# EAGLE design secam-perif94 (EAGLE 6.3)
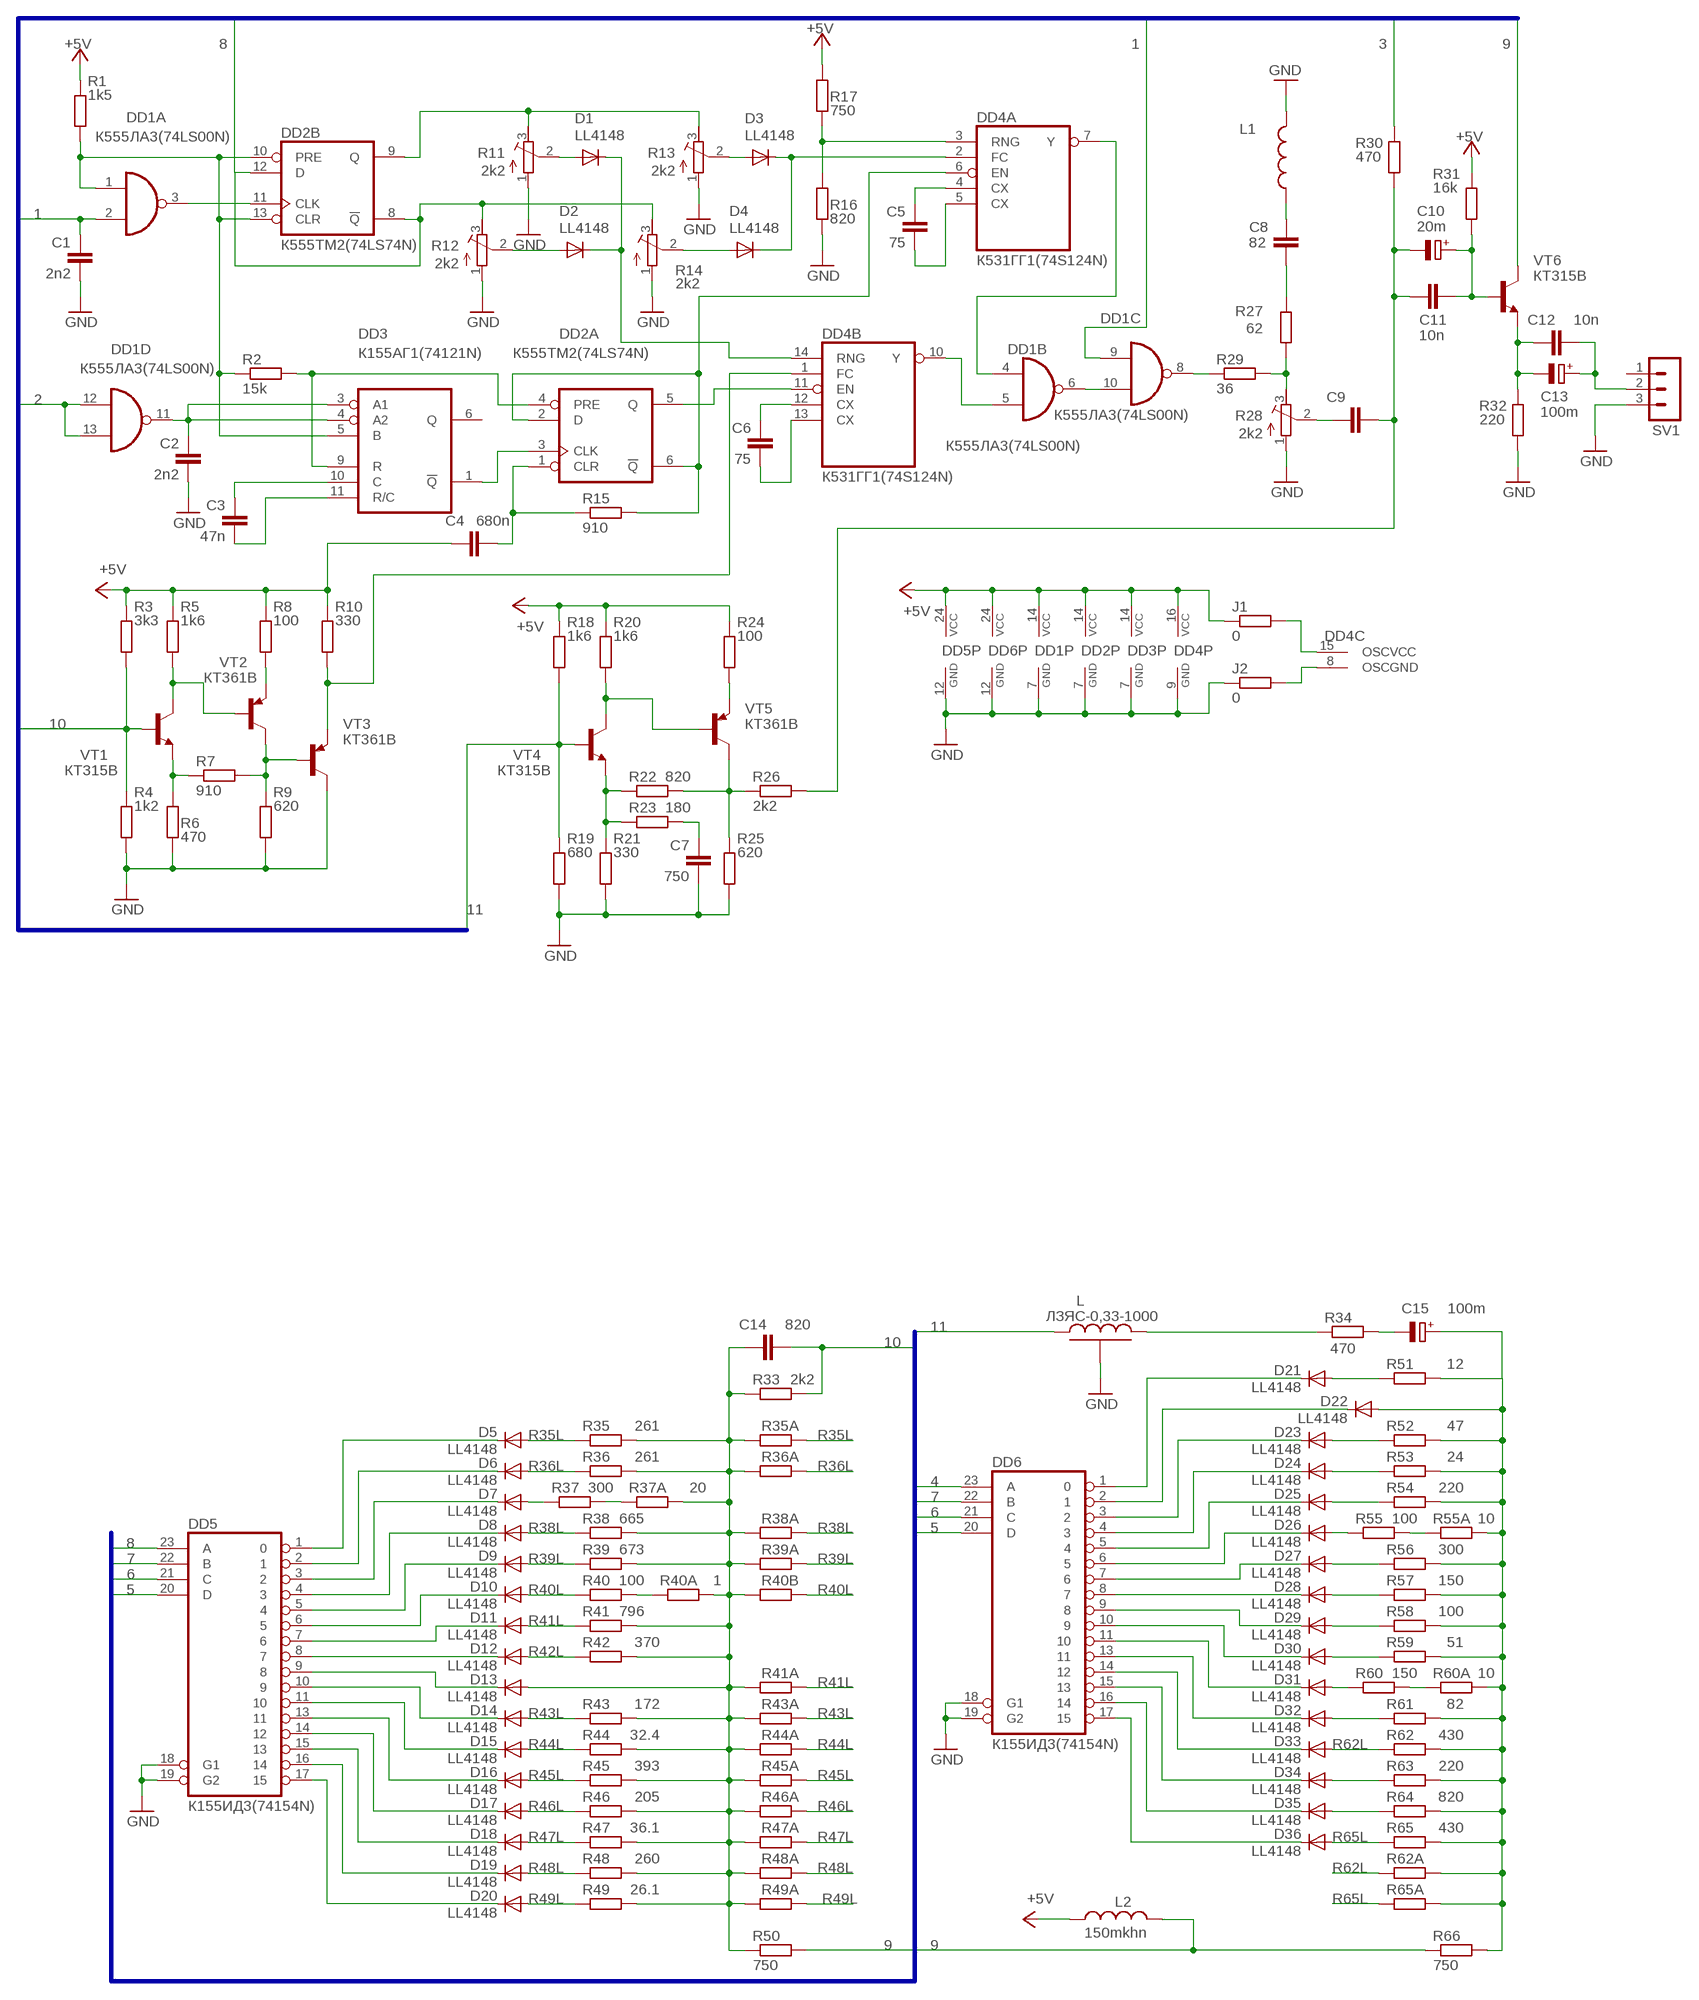
[diagram p0: schematic, sheet 1]

## Parts
C1  2n2  C-EU025-025X050  [C025-025X050]
C2  2n2  C-EU025-025X050  [C025-025X050]
C3  47n  C-EU025-025X050  [C025-025X050]
C4  680n  C-EU025-025X050  [C025-025X050]
C5  75  C-EU025-025X050  [C025-025X050]
C6  75  C-EU025-025X050  [C025-025X050]
C7  750  C-EU025-025X050  [C025-025X050]
C8  82  C-EU025-025X050  [C025-025X050]
C9  C-EU025-025X050  [C025-025X050]
C10  20m  CPOL-EUE2.5-5  [E2,5-5]
C11  10n  C-EU025-025X050  [C025-025X050]
C12  10n  C-EU025-025X050  [C025-025X050]
C13  100m  CPOL-EUE2.5-5  [E2,5-5]
C14  820  C-EU025-025X050  [C025-025X050]
C15  100m  CPOL-EUE2.5-5  [E2,5-5]
D1  LL4148  DIODE-SOD80C  [SOD80C]
D2  LL4148  DIODE-SOD80C  [SOD80C]
D3  LL4148  DIODE-SOD80C  [SOD80C]
D4  LL4148  DIODE-SOD80C  [SOD80C]
D5  LL4148  DIODE-SOD80C  [SOD80C]
D6  LL4148  DIODE-SOD80C  [SOD80C]
D7  LL4148  DIODE-SOD80C  [SOD80C]
D8  LL4148  DIODE-SOD80C  [SOD80C]
D9  LL4148  DIODE-SOD80C  [SOD80C]
D10  LL4148  DIODE-SOD80C  [SOD80C]
D11  LL4148  DIODE-SOD80C  [SOD80C]
D12  LL4148  DIODE-SOD80C  [SOD80C]
D13  LL4148  DIODE-SOD80C  [SOD80C]
D14  LL4148  DIODE-SOD80C  [SOD80C]
D15  LL4148  DIODE-SOD80C  [SOD80C]
D16  LL4148  DIODE-SOD80C  [SOD80C]
D17  LL4148  DIODE-SOD80C  [SOD80C]
D18  LL4148  DIODE-SOD80C  [SOD80C]
D19  LL4148  DIODE-SOD80C  [SOD80C]
D20  LL4148  DIODE-SOD80C  [SOD80C]
D21  LL4148  DIODE-SOD80C  [SOD80C]
D22  LL4148  DIODE-SOD80C  [SOD80C]
D23  LL4148  DIODE-SOD80C  [SOD80C]
D24  LL4148  DIODE-SOD80C  [SOD80C]
D25  LL4148  DIODE-SOD80C  [SOD80C]
D26  LL4148  DIODE-SOD80C  [SOD80C]
D27  LL4148  DIODE-SOD80C  [SOD80C]
D28  LL4148  DIODE-SOD80C  [SOD80C]
D29  LL4148  DIODE-SOD80C  [SOD80C]
D30  LL4148  DIODE-SOD80C  [SOD80C]
D31  LL4148  DIODE-SOD80C  [SOD80C]
D32  LL4148  DIODE-SOD80C  [SOD80C]
D33  LL4148  DIODE-SOD80C  [SOD80C]
D34  LL4148  DIODE-SOD80C  [SOD80C]
D35  LL4148  DIODE-SOD80C  [SOD80C]
D36  LL4148  DIODE-SOD80C  [SOD80C]
DD1  К555ЛА3(74LS00N)  74LS00N  [DIL14]
DD2  К555ТМ2(74LS74N)  74LS74N  [DIL14]
DD3  К155АГ1(74121N)  74121N  [DIL14]
DD4  К531ГГ1(74S124N)  74S124N  [DIL16]
DD5  К155ИД3(74154N)  74154N  [DIL24-6]
DD6  К155ИД3(74154N)  74154N  [DIL24-6]
J1  0  R-EU_M0805  [M0805]
J2  0  R-EU_M0805  [M0805]
L  ЛЗЯС-0,33-1000  [ЛЗЯС-0,33-1000]
L1  L-US0204/7  [0204/7]
L2  150mkhn  L-US0207/15  [0207/15]
R1  1k5  R-EU_M0805  [M0805]
R2  15k  R-EU_M0805  [M0805]
R3  3k3  R-EU_M0805  [M0805]
R4  1k2  R-EU_M0805  [M0805]
R5  1k6  R-EU_M0805  [M0805]
R6  470  R-EU_M0805  [M0805]
R7  910  R-EU_M0805  [M0805]
R8  100  R-EU_M0805  [M0805]
R9  620  R-EU_M0805  [M0805]
R10  330  R-EU_M0805  [M0805]
R11  2k2  R-TRIMM3296W  [RTRIM3296W]
R12  2k2  R-TRIMM3296W  [RTRIM3296W]
R13  2k2  R-TRIMM3296W  [RTRIM3296W]
R14  2k2  R-TRIMM3296W  [RTRIM3296W]
R15  910  R-EU_M0805  [M0805]
R16  820  R-EU_M0805  [M0805]
R17  750  R-EU_M0805  [M0805]
R18  1k6  R-EU_M0805  [M0805]
R19  680  R-EU_M0805  [M0805]
R20  1k6  R-EU_M0805  [M0805]
R21  330  R-EU_M0805  [M0805]
R22  820  R-EU_M0805  [M0805]
R23  180  R-EU_M0805  [M0805]
R24  100  R-EU_M0805  [M0805]
R25  620  R-EU_M0805  [M0805]
R26  2k2  R-EU_M0805  [M0805]
R27  62  R-EU_M0805  [M0805]
R28  2k2  R-TRIMM3296W  [RTRIM3296W]
R29  36  R-EU_M0805  [M0805]
R30  470  R-EU_M0805  [M0805]
R31  16k  R-EU_M0805  [M0805]
R32  220  R-EU_M0805  [M0805]
R33  2k2  R-EU_M0805  [M0805]
R34  470  R-EU_M0805  [M0805]
R35  261  R-EU_M0805  [M0805]
R35A  R-EU_0207/10  [0207/10]
R36  261  R-EU_M0805  [M0805]
R36A  R-EU_0207/10  [0207/10]
R37  300  R-EU_M0805  [M0805]
R37A  20  R-EU_M0805  [M0805]
R38  665  R-EU_M0805  [M0805]
R38A  R-EU_0207/10  [0207/10]
R39  673  R-EU_M0805  [M0805]
R39A  R-EU_0207/10  [0207/10]
R40  100  R-EU_M0805  [M0805]
R40A  1  R-EU_M0805  [M0805]
R40B  R-EU_0207/10  [0207/10]
R41  796  R-EU_M0805  [M0805]
R41A  R-EU_0207/10  [0207/10]
R42  370  R-EU_M0805  [M0805]
R43  172  R-EU_M0805  [M0805]
R43A  R-EU_0207/10  [0207/10]
R44  32.4  R-EU_M0805  [M0805]
R44A  R-EU_0207/10  [0207/10]
R45  393  R-EU_M0805  [M0805]
R45A  R-EU_0207/10  [0207/10]
R46  205  R-EU_M0805  [M0805]
R46A  R-EU_0207/10  [0207/10]
R47  36.1  R-EU_M0805  [M0805]
R47A  R-EU_0207/10  [0207/10]
R48  260  R-EU_M0805  [M0805]
R48A  R-EU_0207/10  [0207/10]
R49  26.1  R-EU_M0805  [M0805]
R49A  R-EU_0207/10  [0207/10]
R50  750  R-EU_M0805  [M0805]
R51  12  R-EU_M0805  [M0805]
R52  47  R-EU_M0805  [M0805]
R53  24  R-EU_M0805  [M0805]
R54  220  R-EU_M0805  [M0805]
R55  100  R-EU_M0805  [M0805]
R55A  10  R-EU_M0805  [M0805]
R56  300  R-EU_M0805  [M0805]
R57  150  R-EU_M0805  [M0805]
R58  100  R-EU_M0805  [M0805]
R59  51  R-EU_M0805  [M0805]
R60  150  R-EU_M0805  [M0805]
R60A  10  R-EU_M0805  [M0805]
R61  82  R-EU_M0805  [M0805]
R62  430  R-EU_M0805  [M0805]
R62A  R-EU_0207/10  [0207/10]
R63  220  R-EU_M0805  [M0805]
R64  820  R-EU_M0805  [M0805]
R65  430  R-EU_M0805  [M0805]
R65A  R-EU_0207/10  [0207/10]
R66  750  R-EU_M0805  [M0805]
SV1  MA03-1  [MA03-1]
VT1  КТ315В  -NPN-TO92-ECB  [TO92-ECB]
VT2  КТ361В  BF421  [TO92-BCE]
VT3  КТ361В  BF421  [TO92-BCE]
VT4  КТ315В  -NPN-TO92-ECB  [TO92-ECB]
VT5  КТ361В  BF421  [TO92-BCE]
VT6  КТ315В  -NPN-TO92-ECB  [TO92-ECB]

## Nets
1: C1.1 DD1.2(A:I1) DD1.9(C:I0)
2: DD1.12(D:I0) DD1.13(D:I1)
3: R30.2
4: DD6.23(A)
5: DD5.20(D) DD6.20(D)
6: DD5.21(C) DD6.21(C)
7: DD5.22(B) DD6.22(B)
8: DD2.8(B:!Q) DD2.12(B:D) DD5.23(A) R12.3(A) R14.3(A)
9: L2.2 R50.2 R66.1 VT6.C
10: C14.2 R3.1 R4.2 R33.2 VT1.B
11: L.1 R18.1 R19.2 VT4.B
+5V: C4.1 DD1.14(P:VCC) DD2.14(P:VCC) DD3.14(VCC) DD4.16(P:VCC) DD5.24(VCC) DD6.24(VCC) J1.1 L2.1 R1.2 R3.2 R5.2 R8.2 R10.2 R17.2 R18.2 R20.2 R24.2 R31.2
GND: C1.2 C2.2 C7.2 DD1.7(P:GND) DD2.7(P:GND) DD3.7(GND) DD4.9(P:GND) DD5.12(GND) DD5.18(G1) DD5.19(G2) DD6.12(GND) DD6.18(G1) DD6.19(G2) J2.1 L1.2 L.G R4.1 R6.1 R9.1 R11.1(E) R12.1(E) R13.1(E) R14.1(E) R16.1 R19.1 R21.1 R25.1 R28.1(E) R32.1 SV1.3 VT3.C
N$1: DD1.1(A:I0) DD2.10(B:PRE) DD2.13(B:CLR) DD3.5(B) R1.1 R2.1
N$2: D7.C DD5.3
N$3: DD1.3(A:O) DD2.11(B:CLK)
N$4: D6.C DD5.2
N$5: D11.C DD5.7
N$6: D10.C DD5.6
N$7: D9.C DD5.5
N$8: D8.C DD5.4
N$9: D5.C DD5.1
N$10: D12.C DD5.8
N$11: D13.C DD5.9
N$12: D14.C DD5.10
N$13: D15.C DD5.11
N$14: D16.C DD5.13
N$15: D17.C DD5.14
N$16: D18.C DD5.15
N$17: D19.C DD5.16
N$18: D20.C DD5.17
N$20: C15.- R34.2
N$21: DD2.9(B:Q) R11.3(A) R13.3(A)
N$22: D1.A R11.2(S)
N$23: D2.A R12.2(S)
N$24: DD1.8(C:O) R29.1
N$25: C14.1 D13.A R33.1 R35.2 R35A.2 R36.2 R36A.2 R37A.2 R38.2 R38A.2 R39.2 R39A.2 R40A.2 R40B.2 R41.2 R41A.2 R42.2 R43.2 R43A.2 R44.2 R44A.2 R45.2 R45A.2 R46.2 R46A.2 R47.2 R47A.2 R48.2 R48A.2 R49.2 R49A.2 R50.1
N$26: D3.A R13.2(S)
N$27: D4.A R14.2(S)
N$28: D7.A R37.1
N$29: D3.C D4.C DD4.2(A:FC)
N$30: C5.1 DD4.4(A:CX)
N$31: C5.2 DD4.5(A:CX)
N$32: DD4.3(A:RNG) R16.2 R17.1
N$33: DD2.2(A:D) DD2.6(A:!Q) DD4.6(A:EN) R15.2
N$34: C3.1 DD3.10(C)
N$35: C2.1 DD1.11(D:O) DD3.3(A1) DD3.4(A2)
N$36: C3.2 DD3.11(R/C)
N$37: DD2.4(A:PRE) DD3.9(R) R2.2
N$38: DD2.5(A:Q) DD4.11(B:EN)
N$39: DD2.3(A:CLK) DD3.1(!Q)
N$40: C4.2 DD2.1(A:CLR) R15.1
N$41: D27.C DD6.7
N$42: D26.C DD6.6
N$43: D25.C DD6.5
N$44: D24.C DD6.4
N$45: D23.C DD6.3
N$46: D22.C DD6.2
N$47: D21.C DD6.1
N$48: D28.C DD6.8
N$49: D29.C DD6.9
N$50: D30.C DD6.10
N$51: D31.C DD6.11
N$52: D32.C DD6.13
N$53: D33.C DD6.14
N$54: D34.C DD6.15
N$55: D35.C DD6.16
N$56: D36.C DD6.17
N$57: R55.2 R55A.1
N$58: D21.A R51.1
N$59: R37.2 R37A.1
N$60: D1.C D2.C DD4.14(B:RNG)
N$61: D27.A R56.1
N$62: D28.A R57.1
N$63: D29.A R58.1
N$64: R60.2 R60A.1
N$66: D30.A R59.1
N$67: D31.A R60.1
N$68: D32.A R61.1
N$69: C15.+ D22.A R51.2 R52.2 R53.2 R54.2 R55A.2 R56.2 R57.2 R58.2 R59.2 R60A.2 R61.2 R62.2 R62A.2 R63.2 R64.2 R65.2 R65A.2 R66.2
N$70: D34.A R63.1
N$71: D35.A R64.1
N$72: C6.1 DD4.12(B:CX)
N$73: C6.2 DD4.13(B:CX)
N$74: L.2 R34.1
N$75: DD1.4(B:I0) DD4.7(A:Y)
N$76: DD1.5(B:I1) DD4.10(B:Y)
N$77: D26.A R55.1
N$78: D25.A R54.1
N$79: D24.A R53.1
N$80: D23.A R52.1
N$81: DD1.6(B:O) DD1.10(C:I1)
N$82: R27.1 R28.3(A) R29.2
N$83: C9.1 R28.2(S)
N$84: C8.1 R27.2
N$85: C8.2 L1.1
N$86: R5.1 VT1.C VT2.B
N$87: C10.+ C11.2 R31.1 VT6.B
N$88: C12.1 C13.- R32.2 VT6.E
N$89: C12.2 C13.+ SV1.2
N$90: C9.2 C10.- C11.1 R26.2 R30.1
N$91: R6.2 R7.1 VT1.E
N$93: R7.2 R9.2 VT2.C VT3.B
N$94: R8.1 VT2.E
N$95: DD4.1(B:FC) R10.1 VT3.E
N$96: R20.1 VT4.C VT5.B
N$97: R21.2 R22.1 R23.1 VT4.E
N$98: DD4.8(C:OSCGND) J2.2
N$99: DD4.15(C:OSCVCC) J1.2
N$100: C7.1 R23.2
N$102: R22.2 R25.2 R26.1 VT5.C
N$103: R24.1 VT5.E
R35L: D5.A R35.1 R35A.1
R36L: D6.A R36.1 R36A.1
R38L: D8.A R38.1 R38A.1
R39L: D9.A R39.1 R39A.1
R40L: D10.A R40.1 R40B.1
R40O: R40.2 R40A.1
R41L: D11.A R41.1 R41A.1
R42L: D12.A R42.1
R43L: D14.A R43.1 R43A.1
R44L: D15.A R44.1 R44A.1
R45L: D16.A R45.1 R45A.1
R46L: D17.A R46.1 R46A.1
R47L: D18.A R47.1 R47A.1
R48L: D19.A R48.1 R48A.1
R49L: D20.A R49.1 R49A.1
R62L: D33.A R62.1 R62A.1
R65L: D36.A R65.1 R65A.1
Unconnected: DD3.6(Q) SV1.1

## Buses
B$2
B$1

## Library data of the parts
C1-C9 C11 C12 C14 = rcl:C-EU: CAPACITOR, European symbol
C10 C13 C15 = rcl:CPOL-EU: POLARIZED CAPACITOR, European symbol
D1-D36 = diode:DIODE-: DIODE
DD1 = 74xx-eu:74*00: Quad 2-input NAND gate
DD2 = 74xx-eu:74*74: Dual D type positive edge triggered FLIP FLOP, preset and clear
DD3 = 74xx-eu:74*121: Monostable MULTIVIBRATOR, schmitt trigger inputs
DD4 = 74xx-eu:74*124: Dual VCO
DD5 DD6 = 74xx-eu:74*154: 4-line to 16-line data SELECTOR/MULTIPLEXER
J1 J2 R1-R10 R15-R27 R29-R35 R35A R36 R36A R37 R37A R38 R38A R39 R39A R40 R40A R40B R41 R41A R42 R43 R43A R44 R44A R45 R45A R46 R46A R47 R47A R48 R48A R49 R49A R50-R55 R55A R56-R60 R60A R61 R62 R62A R63-R65 R65A R66 = rcl:R-EU_: RESISTOR, European symbol
L = ЛЗ:ЛЗЯС-0,33-1000
L1 = resistor:L-US: INDUCTOR, American symbol
L2 = rcl:L-US: INDUCTOR, American symbol
R11-R14 R28 = resistor:R-TRIMM: Trimm resistor
SV1 = con-lstb:MA03-1: PIN HEADER; OC_FARNELL: unknown; OC_NEWARK: unknown
VT1 VT4 VT6 = transistor:*-NPN-: NPN Transistror BF959 corrected 2008.03.06
VT2 VT3 VT5 = transistor-pnp:BF421*: PNP Transistror

## Board
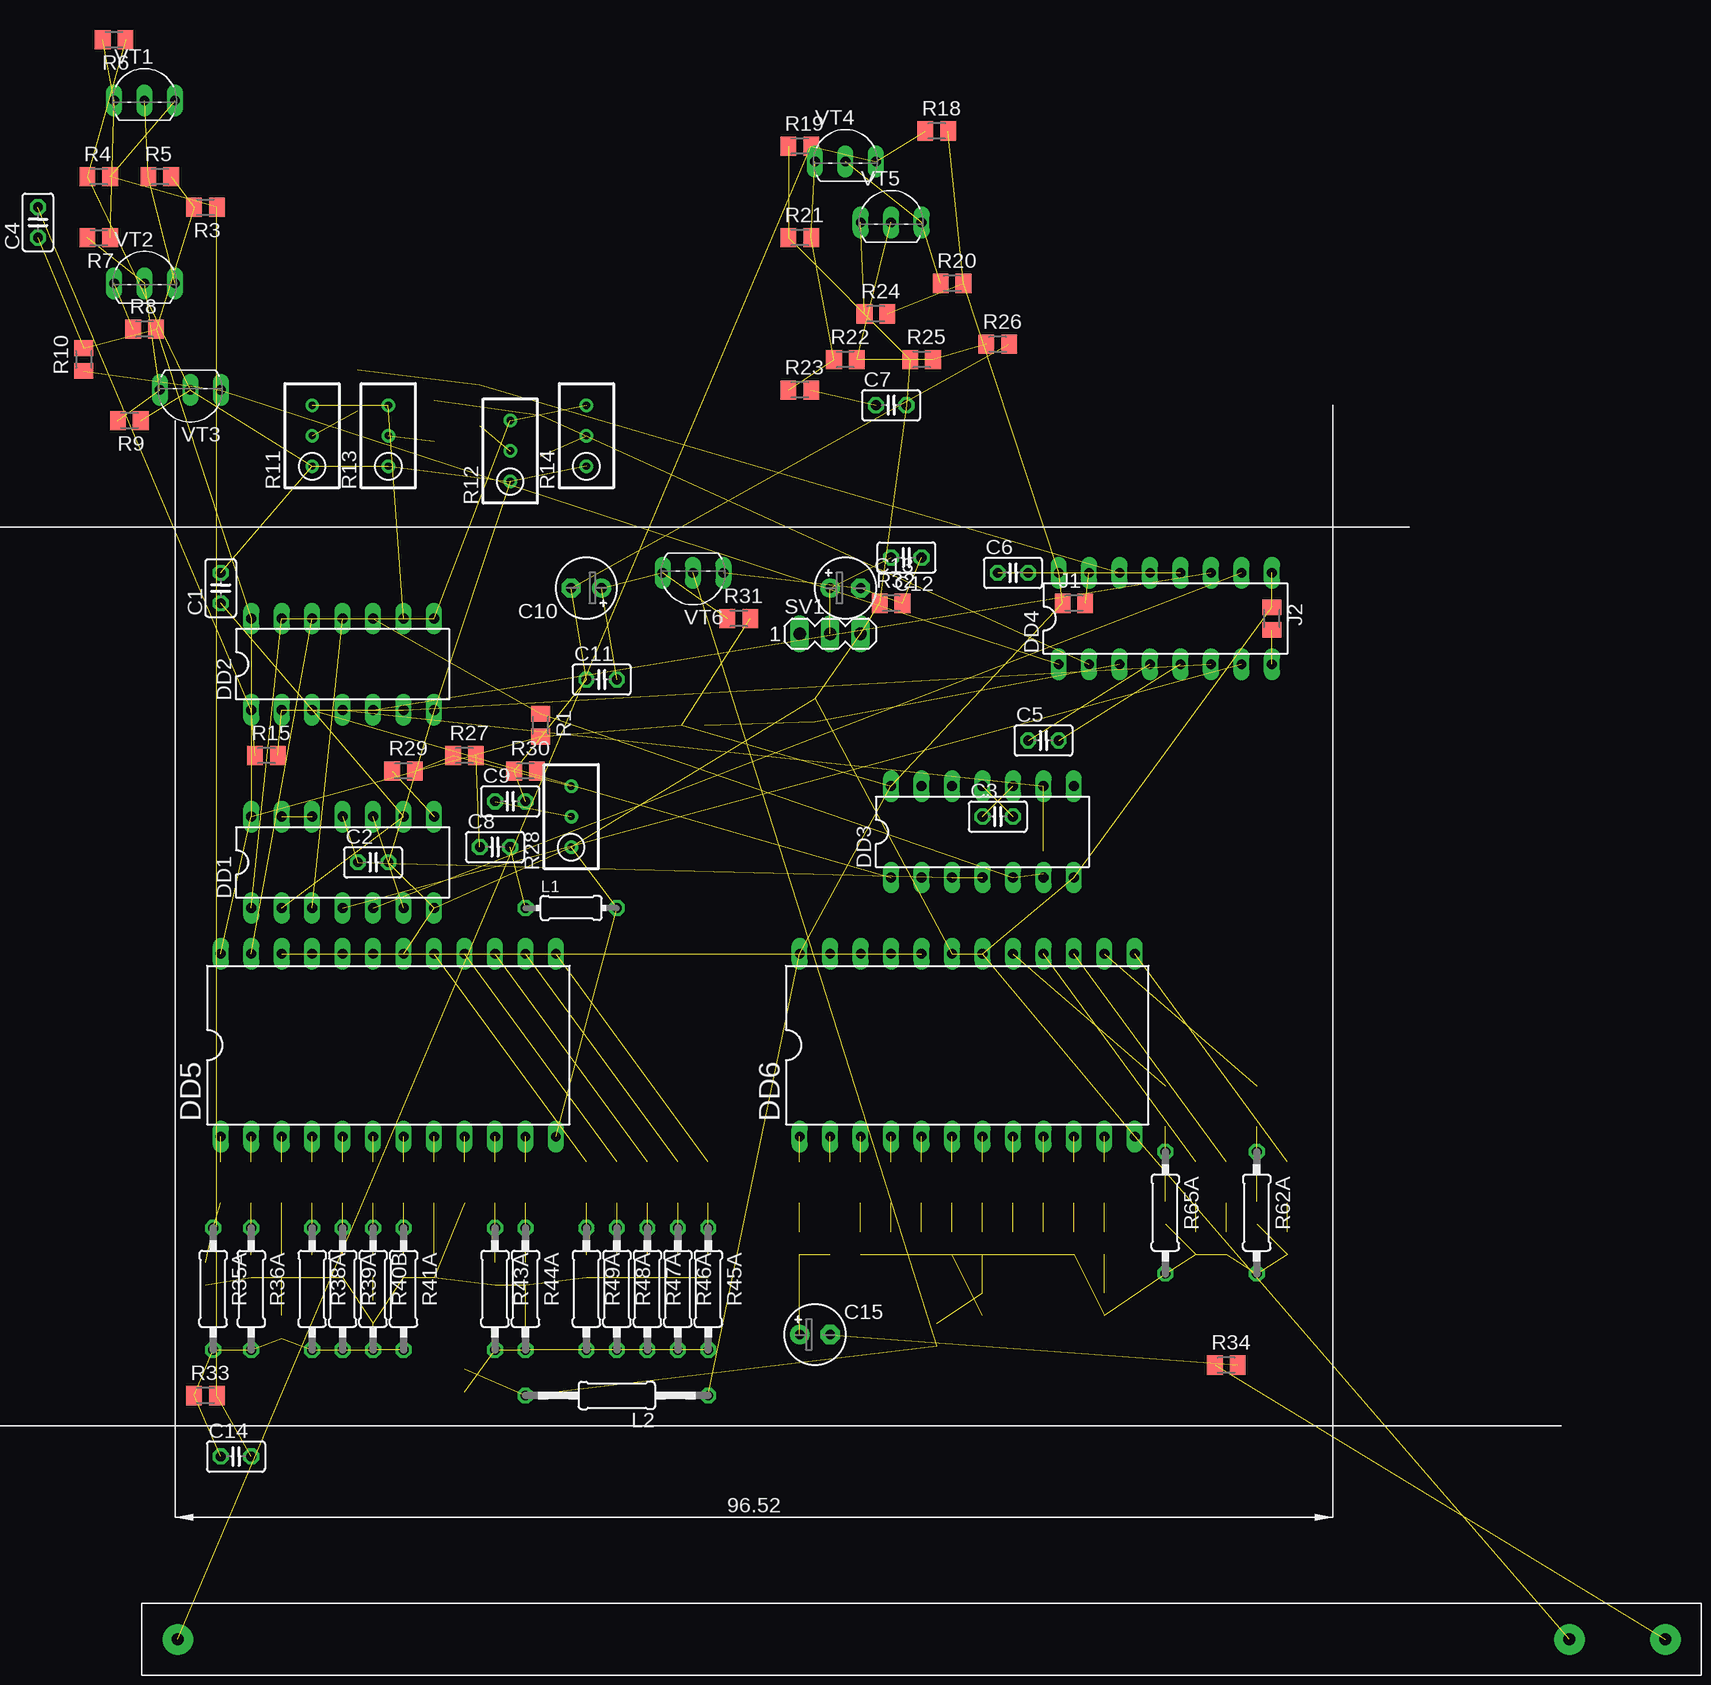
[diagram p1: board, top side]
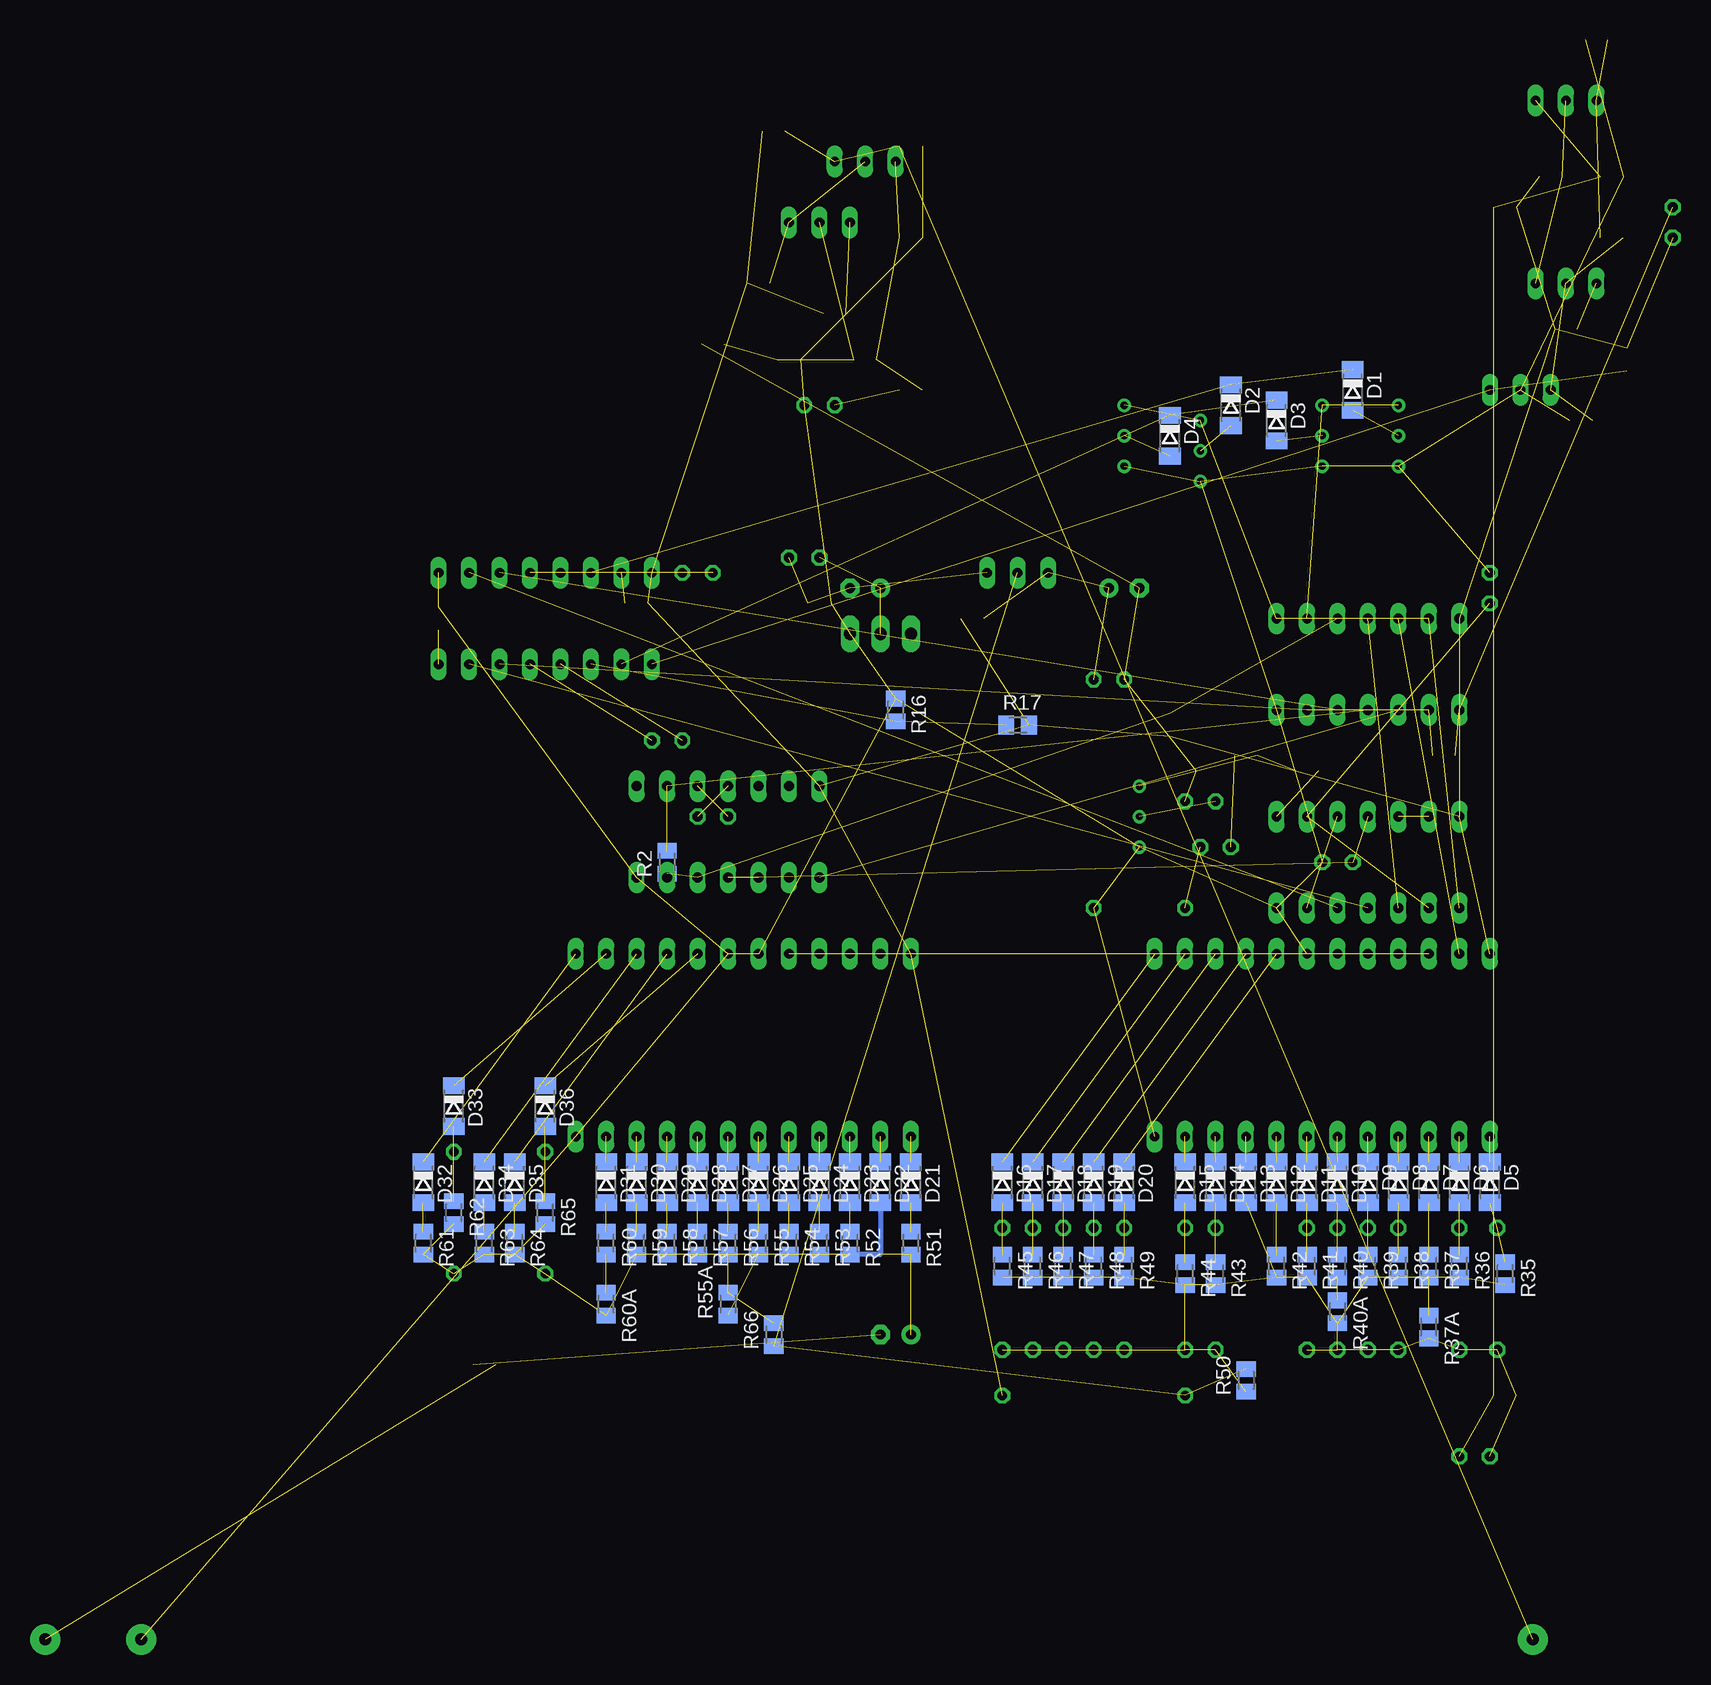
[diagram p2: board, bottom side, seen from below]

No outline drawn. Coordinates in mm, seen from the top.
Copper layers (1*16): Top 0.035mm / dielectric 1.5mm / Bottom 0.035mm
Design rules "default": minimum track width 10mil, minimum drill 24mil, track to track 8mil, track to pad 8mil, pad to pad 8mil, via to via 8mil, smd to smd 8mil, copper to edge 40mil, drill to drill 8mil, minimum pad ring 10mil, minimum via ring 8mil, stop-mask expansion 4mil, vias tented up to drill 0mil, thermal gap 10mil

### Footprints (pad centres in the part's own frame; a part is rotated, then mirrored left to right if it is on the bottom)
C025-025X050 = drill 0.813 octagon: 1 -1.27,0; 2 1.27,0
E2,5-5 = drill 0.813 pad 1.6: + -1.27,0 | drill 0.813 pad 1.6 octagon: - 1.27,0
SOD80C = smd 1.4 x 1.8: A 1.7,0; C -1.7,0
DIL14 = drill 0.813 long: 1 -7.62,-3.81; 2 -5.08,-3.81; 3 -2.54,-3.81; 4 0,-3.81; 5 2.54,-3.81; 6 5.08,-3.81; 7 7.62,-3.81; 8 7.62,3.81; 9 5.08,3.81; 10 2.54,3.81; 11 0,3.81; 12 -2.54,3.81; 13 -5.08,3.81; 14 -7.62,3.81
DIL16 = drill 0.813 long: 1 -8.89,-3.81; 2 -6.35,-3.81; 3 -3.81,-3.81; 4 -1.27,-3.81; 5 1.27,-3.81; 6 3.81,-3.81; 7 6.35,-3.81; 8 8.89,-3.81; 9 8.89,3.81; 10 6.35,3.81; 11 3.81,3.81; 12 1.27,3.81; 13 -1.27,3.81; 14 -3.81,3.81; 15 -6.35,3.81; 16 -8.89,3.81
DIL24-6 = drill 0.813 long: 1 -13.97,-7.62; 2 -11.43,-7.62; 3 -8.89,-7.62; 4 -6.35,-7.62; 5 -3.81,-7.62; 6 -1.27,-7.62; 7 1.27,-7.62; 8 3.81,-7.62; 9 6.35,-7.62; 10 8.89,-7.62; 11 11.43,-7.62; 12 13.97,-7.62; 13 13.97,7.62; 14 11.43,7.62; 15 8.89,7.62; 16 6.35,7.62; 17 3.81,7.62; 18 1.27,7.62; 19 -1.27,7.62; 20 -3.81,7.62; 21 -6.35,7.62; 22 -8.89,7.62; 23 -11.43,7.62; 24 -13.97,7.62
M0805 = smd 1.3 x 1.6: 1 -0.95,0; 2 0.95,0
ЛЗЯС-0,33-1000 = drill 1 pad 2.54: 1 -62,0; 2 62,0; G 54,0
0204/7 = drill 0.813 octagon: 1 -3.81,0; 2 3.81,0
0207/15 = drill 0.813 octagon: 1 -7.62,0; 2 7.62,0
RTRIM3296W = drill 0.61: 1 0,-2.54; 2 0,0; 3 0,2.54
0207/10 = drill 0.813 octagon: 1 -5.08,0; 2 5.08,0
MA03-1 = drill 1.016 long: 1 -2.54,0; 2 0,0; 3 2.54,0
TO92-ECB = drill 0.813 long: B 2.54,0; C 0,0; E -2.54,0
TO92-BCE = drill 0.813 long: B 2.54,0; C 0,0; E -2.54,0

### Placement (x,y rotation side)
C1  8.89,54.61 90 top
C2  21.59,31.75 0 top
C3  73.66,35.56 0 top
C4  -6.35,85.09 90 top
C5  77.47,41.91 0 top
C6  74.93,55.88 0 top
C7  64.77,69.85 0 top
C8  31.75,33.02 0 top
C9  33.02,36.83 0 top
C10  39.37,54.61 180 top
C11  40.64,46.99 0 top
C12  66.04,57.15 180 top
C13  60.96,54.61 0 top
C14  10.16,-17.78 0 top
C15  58.42,-7.62 0 top
D1  20.32,71.12 270 bottom
D2  30.48,69.85 270 bottom
D3  26.67,68.58 270 bottom
D4  35.56,67.31 270 bottom
D5  8.89,5.08 270 bottom
D6  11.43,5.08 270 bottom
D7  13.97,5.08 270 bottom
D8  16.51,5.08 270 bottom
D9  19.05,5.08 270 bottom
D10  21.59,5.08 270 bottom
D11  24.13,5.08 270 bottom
D12  26.67,5.08 270 bottom
D13  29.21,5.08 270 bottom
D14  31.75,5.08 270 bottom
D15  34.29,5.08 270 bottom
D16  49.53,5.08 270 bottom
D17  46.99,5.08 270 bottom
D18  44.45,5.08 270 bottom
D19  41.91,5.08 270 bottom
D20  39.37,5.08 270 bottom
D21  57.15,5.08 270 bottom
D22  59.69,5.08 270 bottom
D23  62.23,5.08 270 bottom
D24  64.77,5.08 270 bottom
D25  67.31,5.08 270 bottom
D26  69.85,5.08 270 bottom
D27  72.39,5.08 270 bottom
D28  74.93,5.08 270 bottom
D29  77.47,5.08 270 bottom
D30  80.01,5.08 270 bottom
D31  82.55,5.08 270 bottom
D32  97.79,5.08 270 bottom
D33  95.25,11.43 270 bottom
D34  92.71,5.08 270 bottom
D35  90.17,5.08 270 bottom
D36  87.63,11.43 270 bottom
DD1  19.05,31.75 0 top
DD2  19.05,48.26 0 top
DD3  72.39,34.29 0 top
DD4  87.63,52.07 0 top
DD5  22.86,16.51 0 top
DD6  71.12,16.51 0 top
J1  80.01,53.34 0 top
J2  96.52,52.07 270 top
L  67.31,-33.02 0 top
L1  38.1,27.94 0 top
L2  41.91,-12.7 180 top
R1  35.56,43.18 270 top
R2  77.47,31.75 90 bottom
R3  7.62,86.36 180 top
R4  -1.27,88.9 0 top
R5  3.81,88.9 0 top
R6  0,100.33 180 top
R7  -1.27,83.82 180 top
R8  2.54,76.2 0 top
R9  1.27,68.58 180 top
R10  -2.54,73.66 90 top
R11  16.51,67.31 0 top
R12  33.02,66.04 0 top
R13  22.86,67.31 0 top
R14  39.37,67.31 0 top
R15  12.7,40.64 0 top
R16  58.42,44.45 270 bottom
R17  48.26,43.18 0 bottom
R18  68.58,92.71 0 top
R19  57.15,91.44 0 top
R20  69.85,80.01 0 top
R21  57.15,83.82 0 top
R22  60.96,73.66 0 top
R23  57.15,71.12 0 top
R24  63.5,77.47 0 top
R25  67.31,73.66 0 top
R26  73.66,74.93 0 top
R27  29.21,40.64 0 top
R28  38.1,35.56 0 top
R29  24.13,39.37 0 top
R30  34.29,39.37 0 top
R31  52.07,52.07 0 top
R32  64.77,53.34 0 top
R33  7.62,-12.7 0 top
R34  92.71,-10.16 0 top
R35  7.62,-2.54 270 bottom
R35A  8.26,-3.81 270 top
R36  11.43,-1.91 270 bottom
R36A  11.43,-3.81 270 top
R37  13.97,-1.91 270 bottom
R37A  13.97,-6.99 270 bottom
R38  16.51,-1.91 270 bottom
R38A  16.51,-3.81 270 top
R39  19.05,-1.91 270 bottom
R39A  19.05,-3.81 270 top
R40  21.59,-1.91 270 bottom
R40A  21.59,-5.71 270 bottom
R40B  21.59,-3.81 270 top
R41  24.13,-1.91 270 bottom
R41A  24.13,-3.81 270 top
R42  26.67,-1.91 270 bottom
R43  31.75,-2.54 270 bottom
R43A  31.75,-3.81 270 top
R44  34.29,-2.54 270 bottom
R44A  34.29,-3.81 270 top
R45  49.53,-1.91 270 bottom
R45A  49.53,-3.81 270 top
R46  46.99,-1.91 270 bottom
R46A  46.99,-3.81 270 top
R47  44.45,-1.91 270 bottom
R47A  44.45,-3.81 270 top
R48  41.91,-1.91 270 bottom
R48A  41.91,-3.81 270 top
R49  39.37,-1.91 270 bottom
R49A  39.37,-3.81 270 top
R50  29.21,-11.43 90 bottom
R51  57.15,0 270 bottom
R52  62.23,0 270 bottom
R53  64.77,0 270 bottom
R54  67.31,0 270 bottom
R55  69.85,0 270 bottom
R55A  72.39,-5.08 90 bottom
R56  72.39,0 270 bottom
R57  74.93,0 270 bottom
R58  77.47,0 270 bottom
R59  80.01,0 270 bottom
R60  82.55,0 270 bottom
R60A  82.55,-5.08 270 bottom
R61  97.79,0 270 bottom
R62  95.25,2.54 270 bottom
R62A  95.25,2.54 270 top
R63  92.71,0 270 bottom
R64  90.17,0 270 bottom
R65  87.63,2.54 270 bottom
R65A  87.63,2.54 270 top
R66  68.58,-7.62 90 bottom
SV1  59.69,50.8 0 top
VT1  2.54,95.25 0 top
VT2  2.54,80.01 0 top
VT3  6.35,71.12 180 top
VT4  60.96,90.17 0 top
VT5  64.77,85.09 0 top
VT6  48.26,55.88 180 top

### Tracks (layer width: path | path; a pad name or v marks a point on that pad's centre or on a via)
1  (2 unrouted)
2  (1 unrouted)
5  (1 unrouted)
6  (1 unrouted)
7  (1 unrouted)
8  (4 unrouted)
9  (3 unrouted)
10  (4 unrouted)
11  (3 unrouted)
+5V  (18 unrouted)
GND  (30 unrouted)
N$1  (5 unrouted)
N$2  (1 unrouted)
N$3  (1 unrouted)
N$4  (1 unrouted)
N$5  (1 unrouted)
N$6  (1 unrouted)
N$7  (1 unrouted)
N$8  (1 unrouted)
N$9  (1 unrouted)
N$10  (1 unrouted)
N$11  (1 unrouted)
N$12  (1 unrouted)
N$13  (1 unrouted)
N$14  (1 unrouted)
N$15  (1 unrouted)
N$16  (1 unrouted)
N$17  (1 unrouted)
N$18  (1 unrouted)
N$20  (1 unrouted)
N$21  (2 unrouted)
N$22  (1 unrouted)
N$23  (1 unrouted)
N$24  (1 unrouted)
N$25  (31 unrouted)
N$26  (1 unrouted)
N$27  (1 unrouted)
N$28  (1 unrouted)
N$29  (2 unrouted)
N$30  (1 unrouted)
N$31  (1 unrouted)
N$32  (2 unrouted)
N$33  (3 unrouted)
N$34  (1 unrouted)
N$35  (3 unrouted)
N$36  (1 unrouted)
N$37  (2 unrouted)
N$38  (1 unrouted)
N$39  (1 unrouted)
N$40  (2 unrouted)
N$41  (1 unrouted)
N$42  (1 unrouted)
N$43  (1 unrouted)
N$44  (1 unrouted)
N$45  (1 unrouted)
N$46  (1 unrouted)
N$47  (1 unrouted)
N$48  (1 unrouted)
N$49  (1 unrouted)
N$50  (1 unrouted)
N$51  (1 unrouted)
N$52  (1 unrouted)
N$53  (1 unrouted)
N$54  (1 unrouted)
N$55  (1 unrouted)
N$56  (1 unrouted)
N$57  (1 unrouted)
N$58  (1 unrouted)
N$59  (1 unrouted)
N$60  (2 unrouted)
N$61  (1 unrouted)
N$62  (1 unrouted)
N$63  (1 unrouted)
N$64  (1 unrouted)
N$66  (1 unrouted)
N$67  (1 unrouted)
N$68  (1 unrouted)
N$69  (18 unrouted)
  Bottom 0.406: D22.A 59.69,-0.95 R52.2
N$70  (1 unrouted)
N$71  (1 unrouted)
N$72  (1 unrouted)
N$73  (1 unrouted)
N$74  (1 unrouted)
N$75  (1 unrouted)
N$76  (1 unrouted)
N$77  (1 unrouted)
N$78  (1 unrouted)
N$79  (1 unrouted)
N$80  (1 unrouted)
N$81  (1 unrouted)
N$82  (2 unrouted)
N$83  (1 unrouted)
N$84  (1 unrouted)
N$85  (1 unrouted)
N$86  (2 unrouted)
N$87  (3 unrouted)
N$88  (3 unrouted)
N$89  (2 unrouted)
N$90  (4 unrouted)
N$91  (2 unrouted)
N$93  (3 unrouted)
N$94  (1 unrouted)
N$95  (2 unrouted)
N$96  (2 unrouted)
N$97  (3 unrouted)
N$98  (1 unrouted)
N$99  (1 unrouted)
N$100  (1 unrouted)
N$102  (3 unrouted)
N$103  (1 unrouted)
R35L  (2 unrouted)
R36L  (2 unrouted)
R38L  (2 unrouted)
R39L  (2 unrouted)
R40L  (2 unrouted)
R40O  (1 unrouted)
R41L  (2 unrouted)
R42L  (1 unrouted)
R43L  (2 unrouted)
R44L  (2 unrouted)
R45L  (2 unrouted)
R46L  (2 unrouted)
R47L  (2 unrouted)
R48L  (2 unrouted)
R49L  (2 unrouted)
R62L  (2 unrouted)
R65L  (2 unrouted)